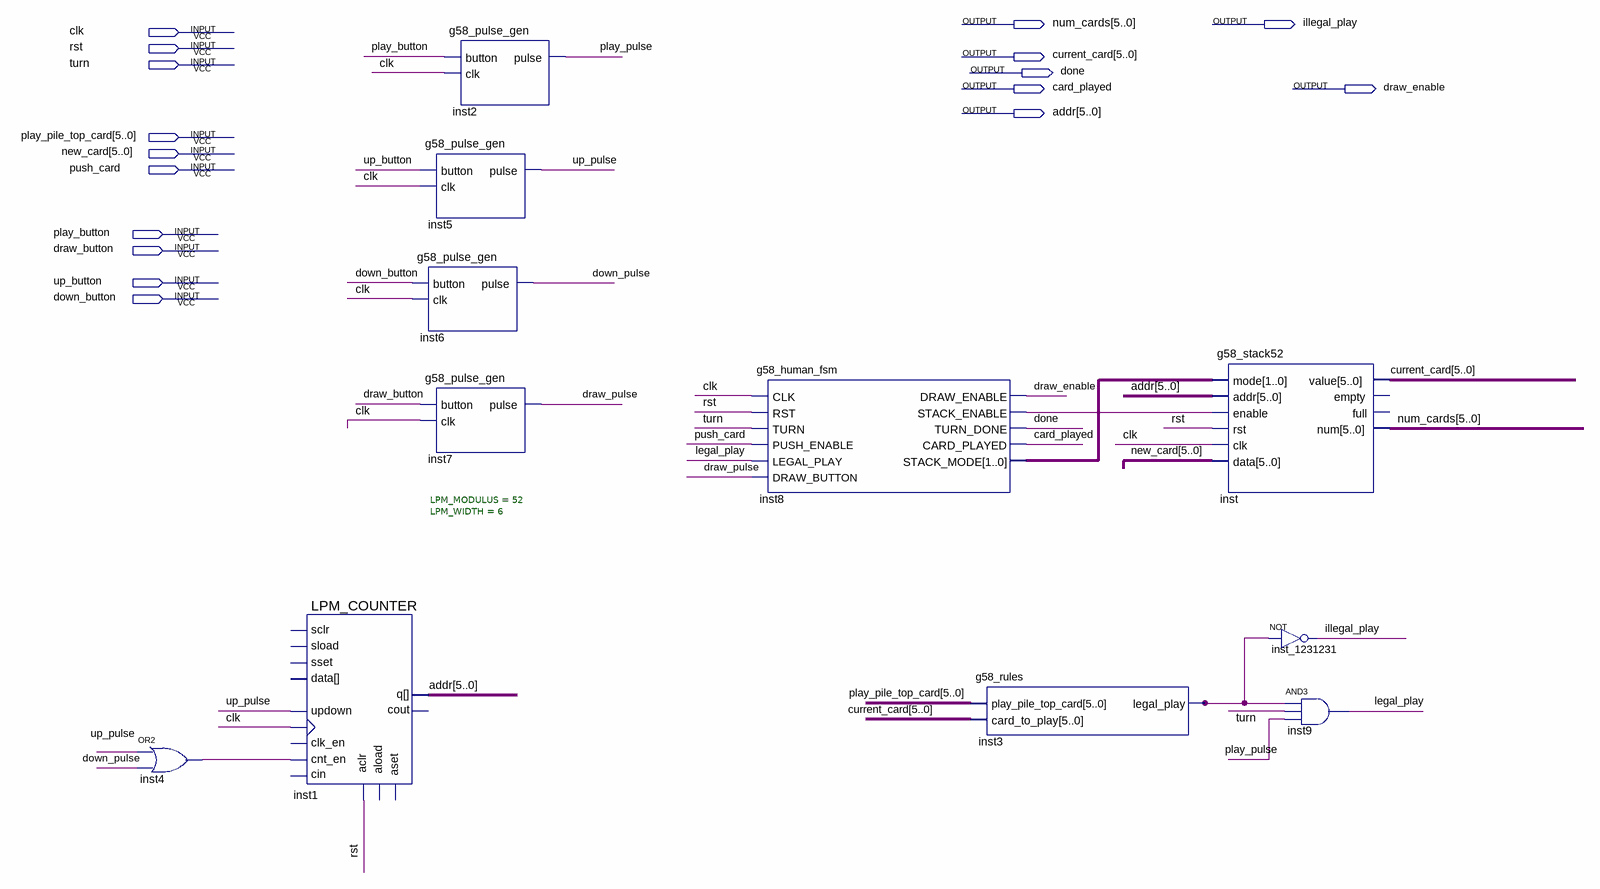
[diagram p0: schematic sheet]
// Quartus schematic g58_human_player.bdf as structural Verilog: 11 symbols, 17 pins
module g58_human_player (
  input  clk,
  input  rst,
  input  turn,
  input  [5:0] play_pile_top_card,
  input  [5:0] new_card,
  input  push_card,
  input  play_button,
  input  draw_button,
  input  up_button,
  input  down_button,
  output [5:0] num_cards,
  output illegal_play,
  output [5:0] current_card,
  output done,
  output card_played,
  output draw_enable,
  output [5:0] addr
);

  wire down_pulse, draw_pulse, inst3_legal_play, inst4_out, inst8_stack_enable, legal_play, play_pulse,
       up_pulse;
  wire [1:0] inst8_stack_mode;

  or inst4 (inst4_out, up_pulse, down_pulse);
  LPM_COUNTER #(.LPM_MODULUS(52), .LPM_WIDTH(6)) inst1 (
    .clock(clk), .aclr(rst), .updown(up_pulse), .cnt_en(inst4_out), .q(addr));  // open: sload, data, clk_en, aload, aset, cin, sset, sclr, cout
  g58_pulse_gen inst2 (.button(play_button), .clk(clk), .pulse(play_pulse));
  g58_pulse_gen inst5 (.button(up_button), .clk(clk), .pulse(up_pulse));
  g58_pulse_gen inst6 (.button(down_button), .clk(clk), .pulse(down_pulse));
  g58_pulse_gen inst7 (.button(draw_button), .clk(clk), .pulse(draw_pulse));
  g58_human_fsm inst8 (
    .CLK(clk), .RST(rst), .TURN(turn), .PUSH_ENABLE(push_card), .LEGAL_PLAY(legal_play),
    .DRAW_BUTTON(draw_pulse), .DRAW_ENABLE(draw_enable), .STACK_ENABLE(inst8_stack_enable), .TURN_DONE(done),
    .CARD_PLAYED(card_played), .STACK_MODE(inst8_stack_mode));
  g58_rules inst3 (.play_pile_top_card(play_pile_top_card), .card_to_play(current_card), .legal_play(inst3_legal_play));
  g58_stack52 inst (
    .mode(inst8_stack_mode), .addr(addr), .enable(inst8_stack_enable), .rst(rst), .clk(clk), .data(new_card),
    .value(current_card), .num(num_cards));  // open: empty, full
  not inst_1231231 (illegal_play, inst3_legal_play);
  and inst9 (legal_play, inst3_legal_play, turn, play_pulse);
endmodule
